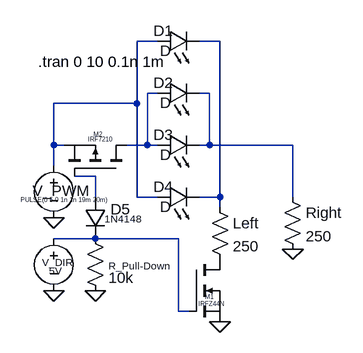
[diagram p0: schematic 2ChannelsProtect.asc]
2ChannelsProtect.asc, the LTspice schematic file:
Version 4
SHEET 1 880 680
WIRE 336 0 304 0
WIRE 432 0 400 0
WIRE 336 80 320 80
WIRE 416 80 400 80
WIRE 304 96 304 0
WIRE 304 96 176 96
WIRE 176 160 176 96
WIRE 192 160 176 160
WIRE 320 160 320 80
WIRE 320 160 288 160
WIRE 336 160 320 160
WIRE 416 160 416 80
WIRE 416 160 400 160
WIRE 544 160 416 160
WIRE 176 192 176 160
WIRE 240 208 208 208
WIRE 240 240 240 208
WIRE 304 240 304 96
WIRE 336 240 304 240
WIRE 432 240 432 0
WIRE 432 240 400 240
WIRE 544 240 544 160
WIRE 432 256 432 240
WIRE 240 304 176 304
WIRE 368 304 240 304
WIRE 368 416 368 304
WIRE 384 416 368 416
FLAG 176 272 0
FLAG 432 432 0
FLAG 544 320 0
FLAG 240 384 0
FLAG 176 384 0
SYMBOL voltage 176 176 R0
WINDOW 0 -33 54 Left 2
WINDOW 3 -51 68 Left 0
WINDOW 123 0 0 Left 0
WINDOW 39 0 0 Left 0
SYMATTR InstName V_PWM
SYMATTR Value PULSE(0 5 0 1n 1n 19m 20m)
SYMBOL voltage 176 288 R0
WINDOW 0 -18 52 Left 1
WINDOW 3 -7 65 Left 1
WINDOW 123 0 0 Left 0
WINDOW 39 0 0 Left 0
SYMATTR InstName V_DIR
SYMATTR Value 5V
SYMBOL res 416 240 R0
SYMATTR InstName Left
SYMATTR Value 250
SYMBOL res 528 224 R0
SYMATTR InstName Right
SYMATTR Value 250
SYMBOL LED 336 16 R270
WINDOW 0 16 9 VTop 2
WINDOW 3 17 12 VBottom 2
SYMATTR InstName D1
SYMBOL LED 336 96 R270
WINDOW 0 16 9 VTop 2
WINDOW 3 17 12 VBottom 2
SYMATTR InstName D2
SYMBOL LED 336 176 R270
WINDOW 0 16 9 VTop 2
WINDOW 3 17 12 VBottom 2
SYMATTR InstName D3
SYMBOL LED 336 256 R270
WINDOW 0 16 9 VTop 2
WINDOW 3 17 12 VBottom 2
SYMATTR InstName D4
SYMBOL nmos 384 336 R0
WINDOW 0 25 57 Left 0
WINDOW 3 15 68 Left 0
SYMATTR InstName M1
SYMATTR Value IRFZ44N
SYMBOL res 224 288 R0
WINDOW 0 36 58 Left 1
SYMATTR InstName R_Pull-Down
SYMATTR Value 10k
SYMBOL pmos 288 208 M270
WINDOW 0 65 51 VLeft 0
WINDOW 3 57 59 VLeft 0
SYMATTR InstName M2
SYMATTR Value IRF7210
SYMBOL diode 224 240 R0
WINDOW 0 39 19 Left 2
WINDOW 3 30 33 Left 1
SYMATTR InstName D5
SYMATTR Value 1N4148
TEXT 152 32 Left 2 !.tran 0 10 0.1n 1m

The netlist it stands for:
* 2ChannelsProtect.asc
V_PWM N001 0 PULSE(0 5 0 1n 1n 19m 20m)
V_DIR N006 0 5V
R§Left N002 P001 250
Right N004 0 250
D1 N001 N002 D
D2 N003 N004 D
D3 N003 N004 D
D4 N001 N002 D
M1 P001 N006 0 0 IRFZ44N
R_Pull-Down N006 0 10k
M2 N003 N005 N001 N001 IRF7210
D5 N005 N006 1N4148
.model D D
.lib standard.dio
.model NMOS NMOS
.model PMOS PMOS
.lib standard.mos
.tran 0 10 0.1n 1m
.backanno
.end